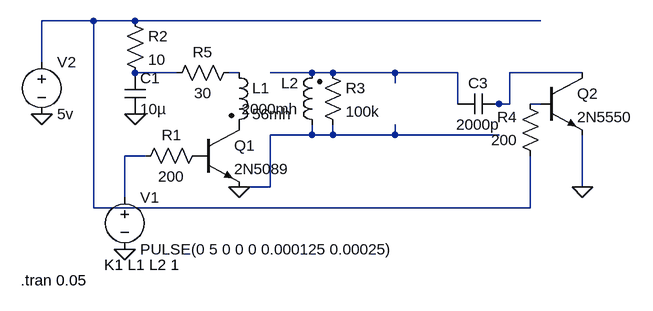
[diagram p0: schematic Draft1.asc]
Draft1.asc, the LTspice schematic file:
Version 4
SHEET 1 880 680
WIRE -400 -144 -480 -144
WIRE -336 -144 -400 -144
WIRE 288 -144 -336 -144
WIRE -480 -80 -480 -144
WIRE -272 -64 -336 -64
WIRE -176 -64 -192 -64
WIRE -64 -64 -128 -64
WIRE -32 -64 -64 -64
WIRE 64 -64 -32 -64
WIRE 160 -64 64 -64
WIRE 352 -64 240 -64
WIRE 64 -48 64 -64
WIRE 160 -16 160 -64
WIRE 224 -16 208 -16
WIRE 240 -16 240 -64
WIRE 240 -16 224 -16
WIRE 288 -16 272 -16
WIRE -64 32 -64 16
WIRE -64 32 -128 32
WIRE -32 32 -32 16
WIRE -32 32 -64 32
WIRE 64 32 64 16
WIRE 64 32 -32 32
WIRE 224 32 64 32
WIRE -320 64 -352 64
WIRE -128 112 -128 32
WIRE -128 112 -176 112
WIRE 352 112 352 32
WIRE -352 128 -352 64
WIRE -400 144 -400 -144
WIRE 272 144 272 64
WIRE 272 144 -400 144
FLAG -352 208 0
FLAG -176 112 0
FLAG -336 0 0
FLAG -480 0 0
FLAG 352 112 0
SYMBOL voltage -352 112 R0
WINDOW 123 0 0 Left 2
WINDOW 39 0 0 Left 2
SYMATTR InstName V1
SYMATTR Value PULSE(0 5 0 0 0 0.000125 0.00025)
SYMBOL res -224 48 R90
WINDOW 0 0 56 VBottom 2
WINDOW 3 32 56 VTop 2
SYMATTR InstName R1
SYMATTR Value 200
SYMBOL npn -240 16 R0
SYMATTR InstName Q1
SYMATTR Value 2N5089
SYMBOL ind2 -192 -80 R0
SYMATTR InstName L1
SYMATTR Value 56mh
SYMATTR Type ind
SYMBOL cap -352 -64 R0
SYMATTR InstName C1
SYMATTR Value 10µ
SYMBOL res -352 -160 R0
SYMATTR InstName R2
SYMATTR Value 10
SYMBOL voltage -480 -96 R0
WINDOW 123 0 0 Left 2
WINDOW 39 0 0 Left 2
SYMATTR InstName V2
SYMATTR Value 5v
SYMBOL ind2 -48 32 R180
WINDOW 0 36 80 Left 2
WINDOW 3 36 40 Left 2
SYMATTR InstName L2
SYMATTR Value 2000mh
SYMATTR Type ind
SYMBOL npn 288 -64 R0
SYMATTR InstName Q2
SYMATTR Value 2N5550
SYMBOL cap 224 -32 R90
WINDOW 0 0 32 VBottom 2
WINDOW 3 32 32 VTop 2
SYMATTR InstName C3
SYMATTR Value 2000p
SYMBOL res 288 80 R180
WINDOW 0 36 76 Left 2
WINDOW 3 36 40 Left 2
SYMATTR InstName R4
SYMATTR Value 200
SYMBOL res -48 -80 R0
SYMATTR InstName R3
SYMATTR Value 100k
SYMBOL res -176 -80 R90
WINDOW 0 0 56 VBottom 2
WINDOW 3 32 56 VTop 2
SYMATTR InstName R5
SYMATTR Value 30
TEXT -384 232 Left 2 !K1 L1 L2 1
TEXT -512 256 Left 2 !.tran 0.05

The netlist it stands for:
* Draft1.asc
V1 N007 0 PULSE(0 5 0 0 0 0.000125 0.00025)
R1 P001 N007 200
Q1 P002 P001 0 0 2N5089
L1 N003 P002 56mh
C1 N002 0 10µ
R2 N001 N002 10
V2 N001 0 5v
L2 0 N004 2000mh
Q2 N005 N006 0 0 2N5550
C3 N005 N004 2000p
R4 N001 N006 200
R3 N004 0 100k
R5 N003 N002 30
.model NPN NPN
.model PNP PNP
.lib standard.bjt
K1 L1 L2 1
.tran 0.05
.backanno
.end